# Altium schematic sheet Pinout.SchDoc: =DocumentName
size 393 x 281 mm; Date: Do not fill; ApprovedBy: Do not fill; CheckedBy: Do not fill; CompanyName: STAR; DrawnBy: Do not fill; Engineer: Do not fill; Organization: STAR; Address1: Avenida Peseta 68, 1ºB; Address2: Madrid, Madrid 28054; Address3: +34603739927; Address4: contact.star@uc3m.es; DocumentNumber: Do not fill; SheetNumber: 4; SheetTotal: 4; Project Name: Purple Pill; Sheet Name: Pinout; Time: Do not fill; ImagePath: Do not fill; Application_BuildNumber: Do not fill
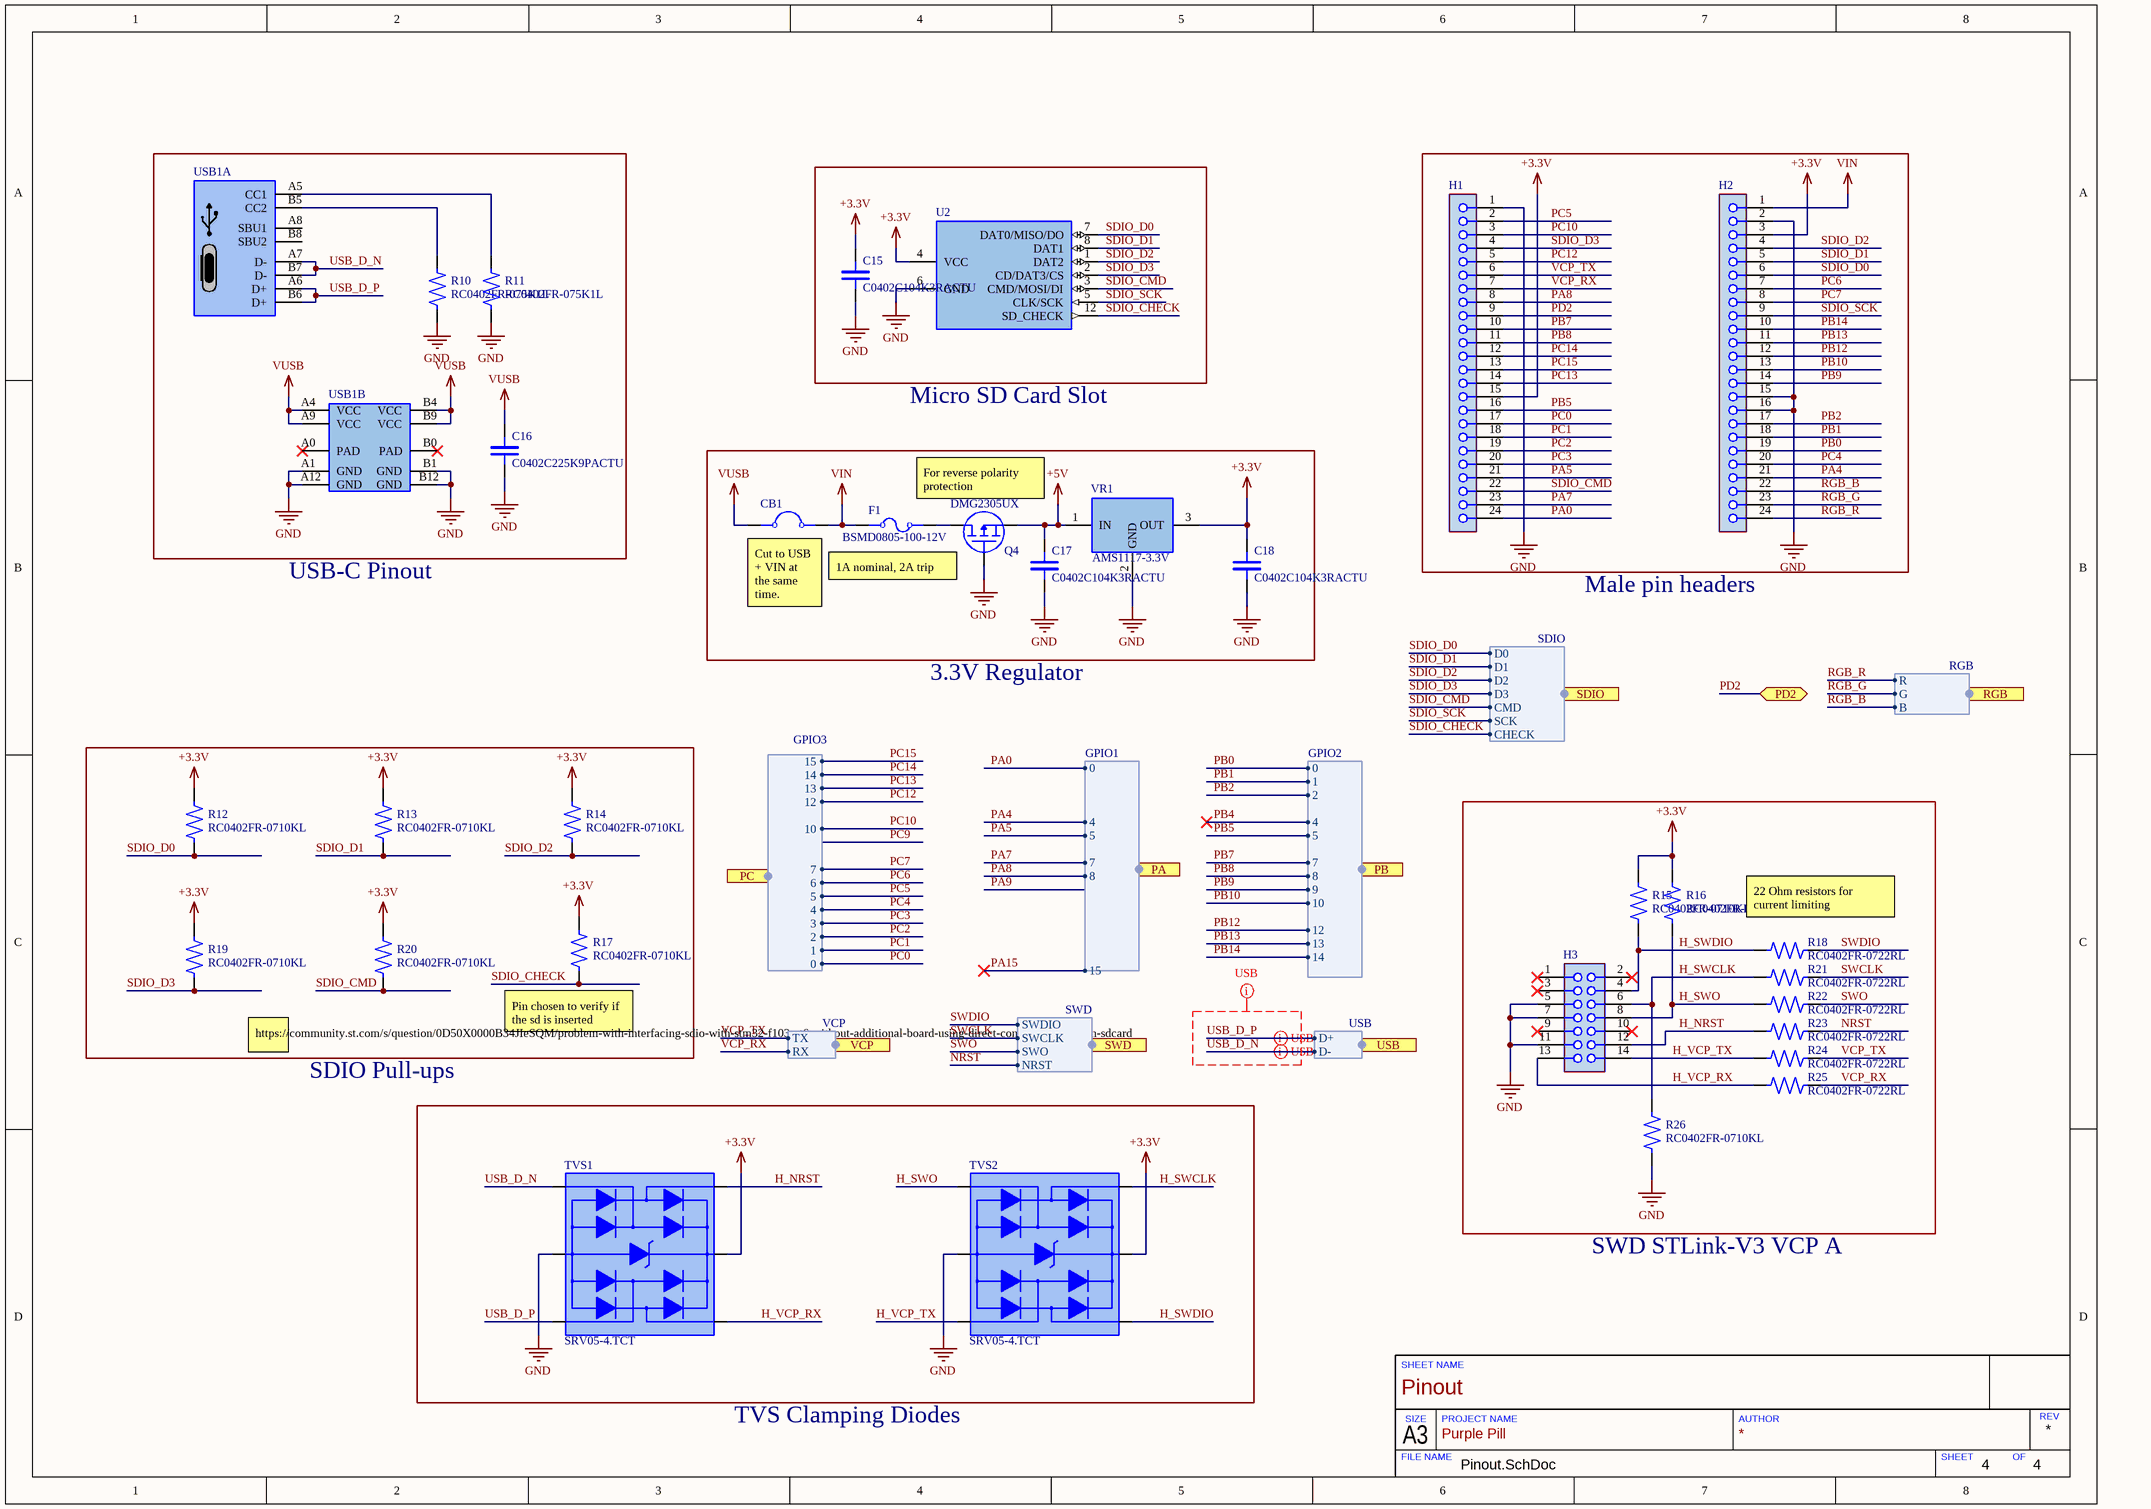
[diagram p0: Pinout.SchDoc]

## Parts
C15  C0402C104K3RACTU  [CM0402_KEMET]
C16  C0402C225K9PACTU  [CM0402_KEMET]
C17  C0402C104K3RACTU  [CM0402_KEMET]
C18  C0402C104K3RACTU  [CM0402_KEMET]
CB1  NC_JumperCircular  [NC_CircleJumper]  (value not drawn)
F1  BSMD0805-100-12V  [PTC0805]
H1  1x24MaleStraight_2.54  [1x24-Male-Straight-Pin_Header]  (value not drawn)
H2  1x24MaleStraight_2.54  [1x24-Male-Straight-Pin_Header]  (value not drawn)
H3  2x07MaleStraight_1.27  [2x07-Male-Straight-Pin_Header_1.27]  (value not drawn)
Q4  DMG2305UX  [SOT23-3]
R10  RC0402FR-075K1L  [R0402_YAGEO]
R11  RC0402FR-075K1L  [R0402_YAGEO]
R12  RC0402FR-0710KL  [R0402_YAGEO]
R13  RC0402FR-0710KL  [R0402_YAGEO]
R14  RC0402FR-0710KL  [R0402_YAGEO]
R15  RC0402FR-0710KL  [R0402_YAGEO]
R16  RC0402FR-0710KL  [R0402_YAGEO]
R17  RC0402FR-0710KL  [R0402_YAGEO]
R18  RC0402FR-0722RL  [R0402_YAGEO]
R19  RC0402FR-0710KL  [R0402_YAGEO]
R20  RC0402FR-0710KL  [R0402_YAGEO]
R21  RC0402FR-0722RL  [R0402_YAGEO]
R22  RC0402FR-0722RL  [R0402_YAGEO]
R23  RC0402FR-0722RL  [R0402_YAGEO]
R24  RC0402FR-0722RL  [R0402_YAGEO]
R25  RC0402FR-0722RL  [R0402_YAGEO]
R26  RC0402FR-0710KL  [R0402_YAGEO]
TVS1  SRV05-4.TCT  [SOT23-6]
TVS2  SRV05-4.TCT  [SOT23-6]
U2  104031-0811  [SMD_MicroSD]  (value not drawn)
USB1  USB4105-GF-A  [USB-C horizontal smd]  (value not drawn)  (parts A,B of 2)
VR1  AMS1117-3.3V  [SOT89]

## Ports
PA (harness GPIO1), PB (harness GPIO2), PC (harness GPIO3), PD2 (bidir), RGB (harness RGB), SDIO (harness SDIO), SWD (harness SWD), USB (harness USB), VCP (harness VCP)

## Harnesses
SWD: SWDIO, SWCLK, SWO, NRST
VCP: TX, RX
GPIO3: 10, 7, 6, 5, 4, 3, 1, 0, 2, 12, 13, 14, 15
GPIO2: 0, 5, 7, 8, 10, 12, 1, 13, 14, 2, 9, 4
GPIO1: 4, 8, 15, 5, 7, 0
USB: D+, D-
SDIO: D3, CMD, SCK, CHECK, D2, D1, D0
RGB: R, G, B

## Nets
+3.3V: C15.2 C18.2 H1.15 H2.3 R12.2 R13.2 R14.2 R15.2 R16.2 R17.2 R19.2 R20.2 TVS1.5(Gnd) TVS2.5(Gnd) U2.4(VCC) VR1.3(OUT)
+5V: C17.2 Q4.2(Source) VR1.1(IN)
GND: C15.1 C16.1 C17.1 C18.1 H1.1 H2.2 H2.15 H2.16 H3.5 H3.7 H3.11 Q4.1(Gate) R10.1 R11.1 R26.1 TVS1.2(VCC) TVS2.2(VCC) U2.6(GND) USB1.A1(GND) USB1.A12(GND) USB1.B1(GND) USB1.B12(GND) VR1.2(GND)
VIN: CB1.2 F1.1 H2.1
VUSB: C16.2 CB1.1 USB1.A4(VCC) USB1.A9(VCC) USB1.B4(VCC) USB1.B9(VCC)
H_NRST: H3.12 R23.2 TVS1.6(TVS1)
H_SWCLK: H3.6 R21.2 R26.2 TVS2.6(TVS1)
H_SWDIO: H3.4 R15.1 R18.2 TVS2.4(TVS4)
H_SWO: H3.8 R16.1 R22.2 TVS2.1(TVS2)
H_VCP_RX: H3.13 R25.2 TVS1.4(TVS4)
H_VCP_TX: H3.14 R24.2 TVS2.3(TVS3)
NRST: R23.1 ; port SWD.NRST
PA0: H1.24 ; port PA.0
PA4: H2.21 ; port PA.4
PA5: H1.21 ; port PA.5
PA7: H1.23 ; port PA.7
PA8: H1.8 ; port PA.8
PA15: port PA.15
PB0: H2.19 ; port PB.0
PB1: H2.18 ; port PB.1
PB2: H2.17 ; port PB.2
PB4: port PB.4
PB5: H1.16 ; port PB.5
PB7: H1.10 ; port PB.7
PB8: H1.11 ; port PB.8
PB9: H2.14 ; port PB.9
PB10: H2.13 ; port PB.10
PB12: H2.12 ; port PB.12
PB13: H2.11 ; port PB.13
PB14: H2.10 ; port PB.14
PC0: H1.17 ; port PC.0
PC1: H1.18 ; port PC.1
PC2: H1.19 ; port PC.2
PC3: H1.20 ; port PC.3
PC4: H2.20 ; port PC.4
PC5: H1.2 ; port PC.5
PC6: H2.7 ; port PC.6
PC7: H2.8 ; port PC.7
PC10: H1.3 ; port PC.10
PC12: H1.5 ; port PC.12
PC13: H1.14 ; port PC.13
PC14: H1.12 ; port PC.14
PC15: H1.13 ; port PC.15
PD2: H1.9 ; port PD2
RGB_B: H2.22 ; port RGB.B
RGB_G: H2.23 ; port RGB.G
RGB_R: H2.24 ; port RGB.R
SDIO_CHECK: R17.1 U2.12(SD_CHECK) ; port SDIO.CHECK
SDIO_CMD: H1.22 R20.1 U2.3(CMD/MOSI/DI) ; port SDIO.CMD
SDIO_D0: H2.6 R12.1 U2.7(DAT0/MISO/DO) ; port SDIO.D0
SDIO_D1: H2.5 R13.1 U2.8(DAT1) ; port SDIO.D1
SDIO_D2: H2.4 R14.1 U2.1(DAT2) ; port SDIO.D2
SDIO_D3: H1.4 R19.1 U2.2(CD/DAT3/CS) ; port SDIO.D3
SDIO_SCK: H2.9 U2.5(CLK/SCK) ; port SDIO.SCK
SWCLK: R21.1 ; port SWD.SWCLK
SWDIO: R18.1 ; port SWD.SWDIO
SWO: R22.1 ; port SWD.SWO
USB_D_N: TVS1.1(TVS2) USB1.A7(D-) USB1.B7(D-) ; port USB.D-
USB_D_P: TVS1.3(TVS3) USB1.A6(D+) USB1.B6(D+) ; port USB.D+
VCP_RX: H1.7 R25.1 ; port VCP.RX
VCP_TX: H1.6 R24.1 ; port VCP.TX
NetF1_2: F1.2 Q4.3(Drain)
NetR10_2: R10.2 USB1.B5(CC2)
NetR11_2: R11.2 USB1.A5(CC1)

Not connected (* = marked no-connect by the designer): H3 1* 2* 3* 9* 10*; USB1 A0(PAD)* A8(SBU1) B0(PAD)* B8(SBU2)

## Layout directives
differential pair: USB_D_N, USB_D_P
rule Undefined; rule Matched Net Lengths [Tolerance = 0.2mm]; rule Impedance Constraint [Min = 85.00    Max = 95.00    ]: USB_D_N, USB_D_P

## Notes on the sheet
- Micro SD Card Slot
- For reverse polarity protection
- USB-C Pinout
- (near Q4) 1A nominal, 2A trip
- (near CB1) Cut to USB + VIN at the same time.
- Male pin headers
- 3.3V Regulator
- RGB LED analog voltages
- Secure Digital Input Output, interface for SD cards
- (near R18) 22 Ohm resistors for current limiting
- https://community.st.com/s/question/0D50X0000B34JIeSQM/problem-with-interfacing-sdio-with-stm32-f103ret6-without-additional-board-using-direct-connection-to-9-pin-sdcard
- (near R17) Pin chosen to verify if the sd is inserted
- SDIO Pull-ups
- Virtual COM port through ST-LINK
- SWD comunication protocol for debug and program
- (near H3) USB D+ & D- differential signal
- SWD STLink-V3 VCP A
- TVS Clamping Diodes
- SHEET NAME
- FILE NAME
- A3
- SIZE
- PROJECT NAME
- AUTHOR
- SHEET
- OF
- REV

## Library data of the parts
C15 C17 C18 = CMP-CAP-002-00024-2: 0.1 µF ±10% 25V Ceramic Capacitor X7R 0402 (1005 Metric; Manufacturer: KEMET; Capacitance: 100nF; Unit weight: 1.5mg; Voltage rating: 25V; Component link: https://octopart.com/c0402c104k3ractu-kemet-71105629?r=sp; Height: 500µm; Mounting type: SMT; Maximun operating temperature: 125°C; Package: 0402; RoHS: Yes; Minimun operating temperature: -55°C; Dielectric: X7R; Tolerance: 10%; LCSC Part#: C1525
C16 = CMP-CAP-002-00025-2: 2.2 µF ±10% 6.3V Ceramic Capacitor X5R 0402 (1005 Metric); Manufacturer: KEMET; Unit weight: 1.5mg; Capacitance: 2.2µF; Height: 500µm; Voltage rating: 6.3V; Mounting type: SMT; Component link: https://octopart.com/c0402c225k9pactu-kemet-46923142?r=sp; Minimun operating temperature: -55°C; RoHS: Yes; Tolerance: 10%; Maximun operating temperature: 125°C; Dielectric: X5R; Package: 0402; LCSC Part#: C77002
CB1 = CMP-00030-00003-1: Jumper normally closed circular circuit breakers
F1 = CMP-FUS-000-00004-2: 12V 1A 40A 500mW -40℃~+85℃ 2A 40mΩ 300ms 270mΩ 0805 Resettable Fuses ROHS; Manufacturer: BHFUSE; Equivalent resistence: 20m; Maximun time to trip: 10s; Resetteable: Yes; Mounting type: SMT; Current rating: 1A; RoHS: Yes; Maximun operating temperature: 85°C; Current trip: 2A; Component link: https://octopart.com/bsmd0805-100-12v-bhfuse-122321729?r=sp; Maximun current hold: 40A; Package: 0805; Voltage rating: 12V; Minimun operating temperature: -40°C; LCSC Part#: C910823
H1 H2 = CMP-CONN-000-00022-1: Connector Header Through Hole 24 position 1 row 0.100" (2.54mm); Manufacturer: Variable; Voltage rating: 1.5kV; Current rating: 3A; Shielding: No; Connector type: Male Pin; Gender: Male; Contact finish: Bronze; Mounting type: SMT; Minimun operating temperature: -25°C; Number of pins: 24; RoHs: Yes; Component link: Variable; Maximun operating temperature: 105°C
H3 = CMP-002-00083-3: Connector Header Through Hole 14 position 2 rows 0.050" (1.27mm); Max Current Rating: 1.75A; Number of Contacts: 14; Gender: Male; Contact Material: Bronze; Length: 8.89mm; Max Operating Temperature: 125°C; Termination: Solder; Housing Color: Black; Depth: 3.43mm; Housing Material: Polymer; Number of Rows: 2; Min Operating Temperature: -55°C; Contact Plating: Gold; Orientation: Straight; Pitch: 1.27mm; Packaging: Rail/Tube
Q4 = CMP-TRAN-002-00012-2: Power Field-Effect Transistor, 4.2A I(D), 20V, 0.052ohm, 1-Element, P-Channel, Silicon, Metal-oxide Semiconductor FET; Manufacturer: Diodes Incorporated; Unit weight: 8mg; V (DS) breakdown: -20V; Rds (ON): 70m; VoltageGS (th): -700mV; Power Dissipation: 1.4W; Channel Type: P; I (GS) leakage: 100nA; I (d) Pulsed: 10A; I (D) Continuous: 4.2A; Package: SOT23-3; Mounting type: SMT; Maximun operating temperature: 150°C; Component link: https://octopart.com/dmg2305ux-13-diodes+inc.-29925594?r=sp; RoHs: Yes; Minimun operating temperature: -55°C; LCSC Part#: C2940629
R10 R11 = CMP-RES-000-00049-3: 5.1 kOhms ±1% 0.063W, 1/16W Chip Resistor 0402 (1005 Metric) Moisture Resistant Thick Film; Manufacturer: YAGEO; Resistance: 5.1k; Temperature coefficient: 100; Power rating: 62.5mW; Unit weight: 650µg; Voltage rating: 50V; Package: 0402; Tolerance: 1%; Mounting type: SMT; Height: 350mm; Maximun operating temperature: 155°C; Component link: https://octopart.com/rc0402fr-075k1l-yageo-39844409?r=sp; Minimun operating temperature: -55°C; RoHS: Yes; LCSC Part#: C105872
R12-R17 R19 R20 R26 = CMP-RES-000-00048-4: 10 kOhms ±1% 0.063W, 1/16W Chip Resistor 0402 (1005 Metric) Moisture Resistant Thick Film; Manufacturer: YAGEO; Temperature coefficient: 100PPM/Cº; Voltage rating: 50V; Resistance: 10k; Unit weight: 650µg; Power rating: 62.5mW; Mounting type: SMT; Maximun operating temperature: 155°C; Component link: https://octopart.com/rc0402fr-0710kl-yageo-55458461?r=sp; Tolerance: 1%; Minimun operating temperature: -55°C; Package: 0402; RoHS: Yes; Height: 350µm; LCSC Part#: C60490
R18 R21-R25 = CMP-RES-000-00052-2: 22 Ohms ±1% 0.063W, 1/16W Chip Resistor 0402 (1005 Metric) Moisture Resistant Thick Film; Manufacturer: YAGEO; Voltage rating: 50V; Temperature coefficient: 100; Unit weight: 650µg; Resistance: 22; Power rating: 62.5mW; Height: 350µm; Component link: https://octopart.com/rc0402fr-0722rl-yageo-40815132?r=sp; RoHS: Yes; Tolerance: 1%; Maximun operating temperature: 155°C; Mounting type: SMT; Minimun operating temperature: -55°C; Package: 0402; LCSC Part#: C114765
TVS1 TVS2 = CMP-DIOD-004-00005-3: Trans Voltage Suppressor Diode, 300W, 5V V(RWM), Unidirectional, 1 Element, Silicon; Manufacturer: Semtech; Breakdown Voltage: 15kV; Diodes Type: Zener and PN; Diode Configuration: Series; Peak Fordward Current: 30A; Junction Capacitance: 3pF; Package: SOT23-6; RoHS: YES; Component Link: https://octopart.com/srv05-4.tct-semtech-587280?r=sp; Mounting Style: SMT; Maximun operating temperature: 125°C; Minimun operating temperature: -25°C; LCSC Part#: C13612
U2 = CMP-CONN-000-00001-8: Micro SD receptacle. Position Card Connector Secure Digital - microSD™ Surface Mount, Right Angle Gold; pin to pad: 6>6+9+10+11+13+14; Manufacturer: Molex; Shielding: Yes; Contact finish: Gold; Component link: https://octopart.com/104031-0811-molex-18195782?r=sp; Connector type: Micro SD; RoHs: Yes; Mounting type: SMT; Number of pins: 9; Height: 1.42m; Gender: Receptacle; LCSC Part#: C585350
USB1 = CMP-CONN-000-00011-10: USB Connectors USB Type C,2.0, Rec,SMT, 0.95mmTH Shell Stakes,G/F,RA,Top Mnt,T&R; Manufacturer: GCT; Shielding: Yes; Voltage rating: 20V; Gender: Female; Unit weight: 768mg; Current rating: 5A; Mounting type: SMT; Minimun operating temperature: -40°C; Contact finish: Copper Alloy; RoHs: Yes; Maximun operating temperature: 85°C; Connector type: USB; Component link: https://octopart.com/usb4105-gf-a-global+connector+technology-107467269?r=sp; Number of pins: 16; Height: 3.31mm; LCSC Part#: C165948
VR1 = CMP-ICS-108-00011-2: 1A 12mA 1.4V@(1A) 0℃~+125℃ Fixed 3.3V~3.3V Positive 1 18V SOT-89 Linear Voltage Regulators (LDO) ROHS; pin to pad: 1>3 2>1 3>2; Manufacturer: MSKSEMI; Dropout voltage: 1.4V; Max output voltage: 3.3V; Accuracy: 1.8%; Number of regulators: 1; Minimun operating temperature: -65°C; Max input voltage: 18V; Max output current: 1A; Component link: https://octopart.com/ams1117-3.3v-wpmtek-122323140?r=sp; LDO theory link: https://bit.ly/3hQmsKW; Mounting type: SMT; Height: 1.6mm; Maximun operating temperature: 150°C; Min/fixed output voltage: 3.3V; Quiescent current: 12mA; Package: SOT-89; Type output voltage: Fixed; RoHS: Yes; LCSC Part#: C5120796